# EAGLE design 360 led stick 3 layer (EAGLE 9.6.2)
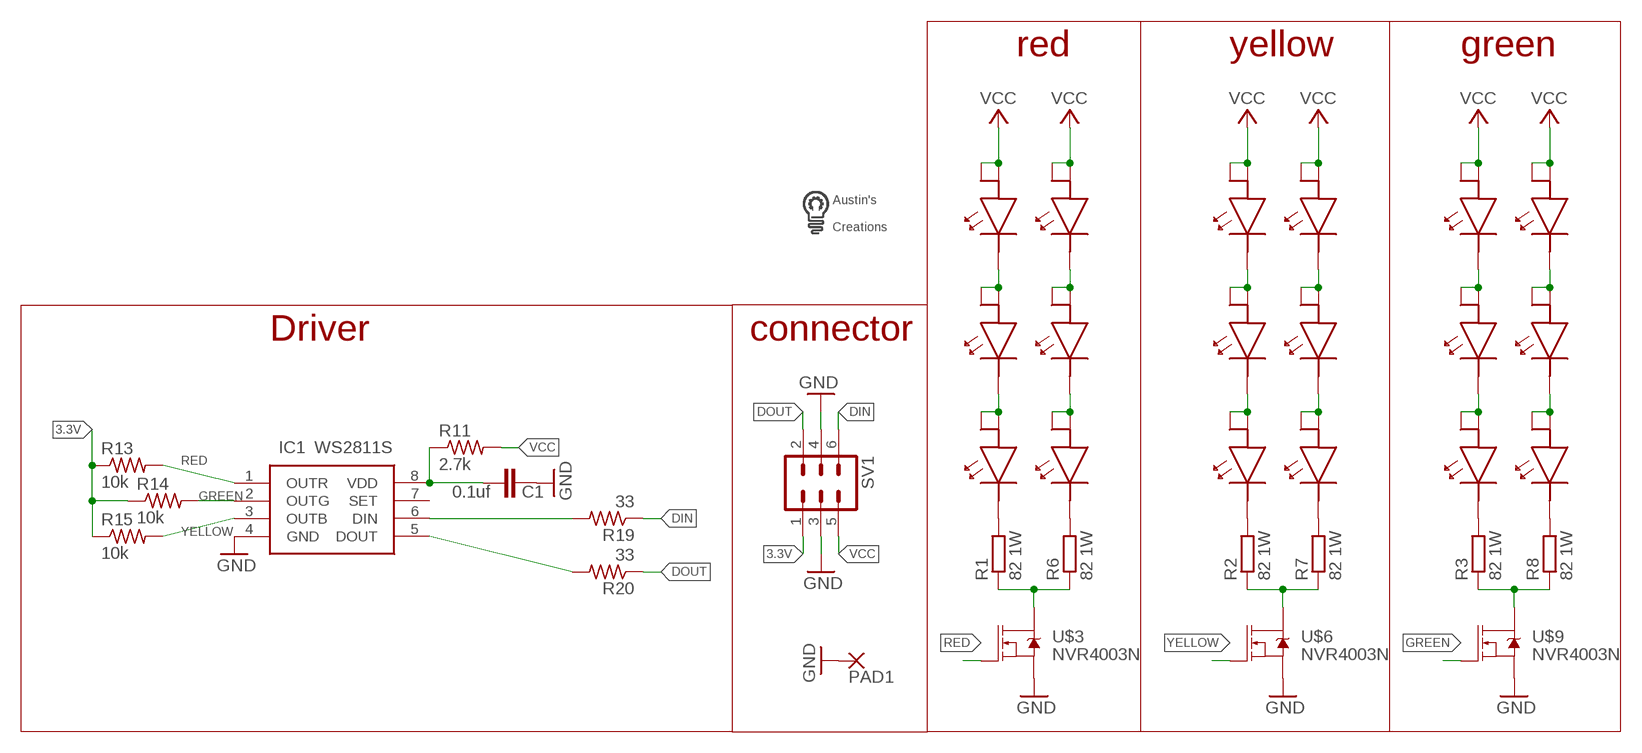
[diagram p0: schematic, sheet 1]

## Parts
C1  0.1uf  C-EUC0603K  [C0603K]
IC1  WS2811S  [SOIC127P600X175-8N]
PAD1  WIREPADSMD1,27-254  [SMD1,27-2,54]
R1  82 1W  R-EU_R1210  [R1210]
R2  82 1W  R-EU_R1210  [R1210]
R3  82 1W  R-EU_R1210  [R1210]
R6  82 1W  R-EU_R1210  [R1210]
R7  82 1W  R-EU_R1210  [R1210]
R8  82 1W  R-EU_R1210  [R1210]
R11  2.7k  R-US_R0603  [R0603]
R13  10k  R-US_R0603  [R0603]
R14  10k  R-US_R0603  [R0603]
R15  10k  R-US_R0603  [R0603]
R19  33  R-US_R0603  [R0603]
R20  33  R-US_R0603  [R0603]
SV1  MA03-2  [MA03-2]
U$1  5730LED  [5730LED]
U$2  5730LED  [5730LED]
U$3  NVR4003N  [SOT23]
U$4  5730LED  [5730LED]
U$5  5730LED  [5730LED]
U$6  NVR4003N  [SOT23]
U$7  5730LED  [5730LED]
U$8  5730LED  [5730LED]
U$9  NVR4003N  [SOT23]
U$10  5730LED  [5730LED]
U$11  5730LED  [5730LED]
U$13  5730LED  [5730LED]
U$21  LOGO  [LOGO]
U$22  5730LED  [5730LED]
U$23  5730LED  [5730LED]
U$24  5730LED  [5730LED]
U$25  5730LED  [5730LED]
U$26  5730LED  [5730LED]
U$27  5730LED  [5730LED]
U$28  5730LED  [5730LED]
U$29  5730LED  [5730LED]
U$30  5730LED  [5730LED]

## Nets
3.3V: R13.1 R14.1 R15.1 SV1.1
DIN: R19.1 SV1.6
DOUT: R20.1 SV1.2
GND: C1.1 IC1.4(GND) PAD1.1(P) SV1.3 SV1.4 U$3.3(S) U$6.3(S) U$9.3(S)
GREEN: IC1.2(OUTG) R14.2 U$9.2(G)
N$1: U$1.P$2 U$2.P$1 U$2.P$3
N$2: U$2.P$2 U$4.P$1 U$4.P$3
N$3: R1.2 U$4.P$2
N$4: U$5.P$2 U$7.P$1 U$7.P$3
N$5: U$7.P$2 U$8.P$1 U$8.P$3
N$6: R2.2 U$8.P$2
N$7: U$10.P$2 U$11.P$1 U$11.P$3
N$8: U$11.P$2 U$13.P$1 U$13.P$3
N$9: R3.2 U$13.P$2
N$10: IC1.5(DOUT) R20.2
N$16: R1.1 R6.1 U$3.1(D)
N$17: R2.1 R7.1 U$6.1(D)
N$18: R3.1 R8.1 U$9.1(D)
N$21: U$22.P$2 U$23.P$1 U$23.P$3
N$22: U$23.P$2 U$24.P$1 U$24.P$3
N$23: R6.2 U$24.P$2
N$24: U$25.P$2 U$26.P$1 U$26.P$3
N$25: U$26.P$2 U$27.P$1 U$27.P$3
N$26: R7.2 U$27.P$2
N$27: U$28.P$2 U$29.P$1 U$29.P$3
N$28: U$29.P$2 U$30.P$1 U$30.P$3
N$29: R8.2 U$30.P$2
N$39: C1.2 IC1.8(VDD) R11.1
N$40: IC1.6(DIN) R19.2
RED: IC1.1(OUTR) R13.2 U$3.2(G)
VCC: R11.2 SV1.5 U$1.P$1 U$1.P$3 U$5.P$1 U$5.P$3 U$10.P$1 U$10.P$3 U$22.P$1 U$22.P$3 U$25.P$1 U$25.P$3 U$28.P$1 U$28.P$3
YELLOW: IC1.3(OUTB) R15.2 U$6.2(G)
Unconnected: IC1.7(SET)

## Notes on the sheet
- red | yellow | green
- Driver | connector

## Library data of the parts
C1 = rcl:C-EU: CAPACITOR, European symbol; SPICEPREFIX: C
IC1 = SamacSys_Parts:WS2811S: RGB led driver Source: Datasheet <https://cdn-shop.adafruit.com/datasheets/WS2811.pdf>; DESCRIPTION: RGB led driver; HEIGHT: 1.75mm; MANUFACTURER_NAME: Worldsemi; MANUFACTURER_PART_NUMBER: ws2811s
PAD1 = wirepad:WIREPAD: Wire PAD connect wire on PCB
R1-R3 R6-R8 = resistor:R-EU_: RESISTOR, European symbol
R11 R13-R15 R19 R20 = resistor:R-US_: RESISTOR, American symbol
SV1 = con-lstb:MA03-2: PIN HEADER; OC_FARNELL: unknown; OC_NEWARK: unknown
U$1 U$2 U$4 U$5 U$7 U$8 U$10 U$11 U$13 U$22-U$30 = custom parts:5730LED
U$3 U$6 U$9 = custom parts:NVR4003N
U$21 = custom parts:LOGO

## Board
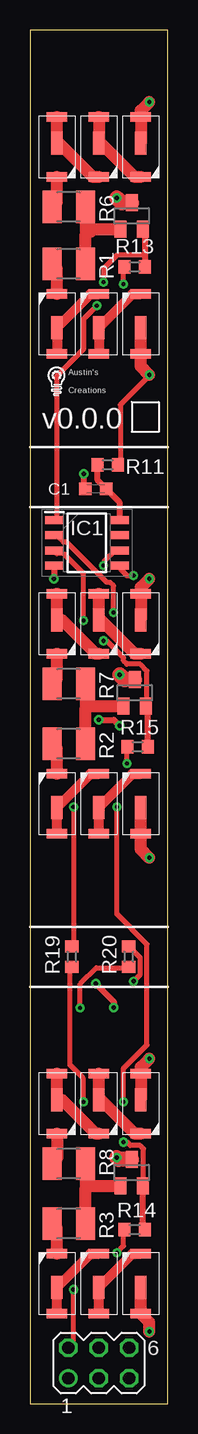
[diagram p1: board, top side]
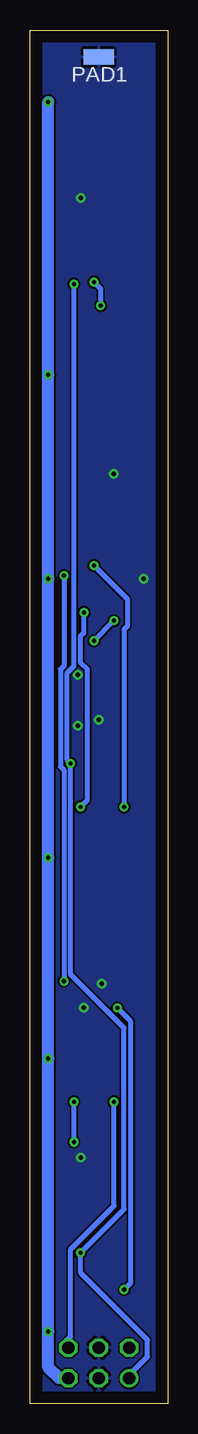
[diagram p2: board, bottom side, seen from below]

Size 11.5 x 114.5 mm. Coordinates in mm from the lower left corner, seen from the top.
Outline: 11.5,0 11.5,114.5 0,114.5 0,0 11.5,0
Copper layers (1*16): Top 0.035mm / dielectric 1.5mm / Bottom 0.035mm
Design rules "default *": minimum track width 16mil, minimum drill 0.35mm, track to track 6mil, track to pad 6mil, pad to pad 6mil, via to via 6mil, smd to smd 6mil, copper to edge 40mil, drill to drill 6mil, minimum pad ring 10mil, minimum via ring 8mil, stop-mask expansion 4mil, vias tented up to drill 0mil, thermal gap 10mil

### Footprints (pad centres in the part's own frame; a part is rotated, then mirrored left to right if it is on the bottom)
C0603K = smd 1.05 x 1.08: 1 -0.875,0; 2 0.875,0
SOIC127P600X175-8N = smd 1.55 x 0.65: 1 -2.725,1.905; 2 -2.725,0.635; 3 -2.725,-0.635; 4 -2.725,-1.905; 5 2.725,-1.905; 6 2.725,-0.635; 7 2.725,0.635; 8 2.725,1.905
SMD1,27-2,54 = smd 1.27 x 2.54: 1 0,0
R1210 = smd 1.6 x 2.7: 1 -1.4,0; 2 1.4,0
R0603 = smd 1 x 1.1: 1 -0.85,0; 2 0.85,0
MA03-2 = drill 1.016: 1 -2.54,-1.27 | drill 1.016 octagon: 2 -2.54,1.27; 3 0,-1.27; 4 0,1.27; 5 2.54,-1.27; 6 2.54,1.27
5730LED = smd 0.813 x 1.676: P$1 -2.5,0; P$2 2.5,0 | smd 1.93 x 0.965: P$3 -0.3,0
SOT23 = smd 1 x 1.4: 1 -0.95,-1.1; 2 0.95,-1.1; 3 0,1.1

### Placement (x,y rotation side)
C1  5.5,76.25 0 top
IC1  4.75,71.75 0 top
PAD1  5.75,112.25 90 bottom
R1  3.25,95 180 top
R2  3.25,55 180 top
R3  3.25,15 180 top
R6  3.25,99.75 180 top
R7  3.25,60 180 top
R8  3.25,20 180 top
R11  6.5,78.25 0 top
R13  8.75,94.75 0 top
R14  8.75,14.5 0 top
R15  9,54.75 0 top
R19  3.5,37.25 90 top
R20  8.25,37.25 90 top
SV1  5.75,3.38 0 top
U$1  9.25,90 90 top
U$2  5.75,90 90 top
U$3  8.5,99 0 top
U$4  2.25,90 90 top
U$5  9.25,50 90 top
U$6  8.75,59.25 0 top
U$7  5.75,50 90 top
U$8  2.25,50 90 top
U$9  8.5,19.25 0 top
U$10  9.25,10 90 top
U$11  5.75,10 90 top
U$13  2.25,10 90 top
U$21  1.5,84 0 top
U$22  9.25,104.75 270 top
U$23  5.75,104.75 270 top
U$24  2.25,104.75 270 top
U$25  9.25,65 270 top
U$26  5.75,65 270 top
U$27  2.25,65 270 top
U$28  9.25,25 270 top
U$29  5.75,25 270 top
U$30  2.25,25 270 top

### Tracks (layer width: path | path; a pad name or v marks a point on that pad's centre or on a via)
3.3V  (via drill 0.35)
  Top 0.406: v7.26,12.57 7.82,13.13 7.82,14.25 R14.1 | v8.1,53.37 8.1,54.48 R15.1 | v7.82,93.32 7.82,94.72 R13.1
  Bottom 0.406: SV1.1 3.35,2.23 1.68,3.91 1.68,5.31 7.26,10.9 v7.26,12.57 3.63,16.2 3.63,31.29 8.1,35.76 v8.1,53.37 8.38,53.65 8.38,60.91 7.82,61.47 v7.82,93.32
DIN  (via drill 0.35)
  Top 0.406: v4.47,25.15 4.47,27.1 3.35,28.22 3.35,36.32 R19.1
  Bottom 0.406: v4.47,25.15 4.47,16.48 8.1,12.85 8.1,5.59 8.38,5.31 8.38,4.75 SV1.6
DOUT  (via drill 0.35)
  Top 0.406: v4.19,32.97 4.19,34.97 5.54,36.32 8.1,36.32 R20.1 | v3.63,9.5 3.63,5.03 3.35,4.75 SV1.2
  Bottom 0.406: v4.19,32.97 3.07,31.85 3.07,10.06 v3.63,9.5
GND  (via drill 0.35)
  Top 0.508: IC1.4 2.02,68.78 v2,68.75 | C1.1 4.5,76.38 v4.5,77.5 | v5.75,57 7,57 v7.5,56.5 | v5.5,35 7,33.5 v7,33
  Top 1.27: U$3.3 7.65,100.1 v7.25,100.5 | U$6.3 7.9,60.35 v7.5,60.75 | U$9.3 7.4,20.35 v7.25,20.5
  pour Bottom: 0,114.5 0,0 11.5,0 11.5,114.5
GREEN  (via drill 0.35)
  Top 0.406: v6.99,65.94 6.99,68.17 6.71,68.45 6.43,68.45 3.07,71.81 2.79,71.81 2.23,72.36 IC1.2 | v7.26,49.73 7.26,40.79 9.78,38.28 9.78,29.9 7.82,27.94 v7.82,25.15 | v7.82,21.79 8.1,21.79 8.38,21.51 9.22,21.51 9.5,21.23 9.5,18.16 U$9.2
  Top 0.508: R14.2 9.45,14.65 U$9.2
  Bottom 0.406: v6.99,65.94 6.99,64.26 7.26,63.98 7.26,61.75 6.71,61.19 6.71,50.29 v7.26,49.73 | v7.82,21.79 v7.82,25.15
N$1
  Top 0.813: U$2.P$1 U$2.P$3 8.55,92.5 U$1.P$2
N$2
  Top 0.813: U$4.P$1 U$4.P$3 5.05,92.5 U$2.P$2
N$3
  Top 1.016: U$4.P$2 2.25,94.6 R1.2
N$4
  Top 0.813: U$7.P$1 U$7.P$3 8.55,52.5 U$5.P$2
N$5
  Top 0.813: U$8.P$1 U$8.P$3 5.05,52.5 U$7.P$2
N$6
  Top 1.016: U$8.P$2 2.25,54.6 R2.2
N$7
  Top 0.813: U$11.P$1 U$11.P$3 8.55,12.5 U$10.P$2
N$8
  Top 0.813: U$13.P$1 U$13.P$3 5.05,12.5 U$11.P$2
N$9
  Top 1.016: U$13.P$2 2.25,14.6 R3.2
N$10  (via drill 0.35)
  Top 0.406: v8.66,35.2 9.22,35.76 9.22,37.16 8.38,38 R20.2 | v8.66,69.01 8.1,69.01 7.54,69.57 IC1.5
  Bottom 0.406: v8.66,35.2 8.66,52.81 8.94,53.09 8.94,61.19 8.66,61.47 v8.66,69.01
N$16
  Top 1.016: 4.8,97.65 4.65,97.5 R1.1 | 4.8,97.65 5.05,97.65 5.3,97.9 U$3.1 | R6.1 4.65,97.8 4.8,97.65
N$17
  Top 1.016: 4.8,58.15 4.65,58 R2.1 | 4.8,58.15 U$6.1 | R7.1 4.65,58.3 4.8,58.15
N$18
  Top 1.016: R3.1 4.65,18 4.8,18.15 | 4.8,18.15 U$9.1 | R8.1 4.65,18.3 4.8,18.15
N$21
  Top 1.016: U$23.P$1 U$23.P$3 5.95,105.05 8.75,102.25 U$22.P$2
N$22
  Top 1.016: U$24.P$1 U$24.P$3 2.45,105.05 5.25,102.25 U$23.P$2
N$23
  Top 1.016: R6.2 2.25,100.15 U$24.P$2
N$24
  Top 1.016: U$26.P$1 U$26.P$3 5.95,65.3 8.75,62.5 U$25.P$2
N$25
  Top 1.016: U$27.P$1 U$27.P$3 2.7,65.3 5.5,62.5 U$26.P$2
N$26
  Top 1.016: R7.2 2.25,60.4 U$27.P$2
N$27
  Top 1.016: U$29.P$1 U$29.P$3 5.95,25.3 8.75,22.5 U$28.P$2
N$28
  Top 1.016: U$30.P$1 U$30.P$3 2.7,25.3 5.5,22.5 U$29.P$2
N$29
  Top 1.016: U$30.P$2 2.25,20.4 R8.2
N$39
  Top 0.508: IC1.8 7.47,75.15 C1.2 5.65,76.97 R11.1
N$40  (via drill 0.35)
  Top 0.406: v3.63,49.73 3.63,38.28 R19.2 | v6.15,69.85 6.15,70.13 7.26,71.25 IC1.6
  Bottom 0.406: v3.63,49.73 3.63,64.54 3.35,64.82 3.35,67.06 v6.15,69.85
RED  (via drill 0.35)
  Top 0.406: v5.59,91.52 4.47,90.41 4.47,87.89 2.23,85.66 2.23,73.92 IC1.1 | v6.15,93.48 6.15,94.6 7.26,95.71 9.6,95.71
  Top 0.508: U$3.2 9.6,97.75 9.6,95.71 R13.2
  Bottom 0.406: v5.59,91.52 5.59,92.92 v6.15,93.48
VCC  (via drill 0.35)
  Top 0.406: R11.2 7.54,78.51 7.54,83.26 9.78,85.5 v9.98,85.75
  Top 1.016: v9.98,108.5 9.25,107.77 U$22.P$1 U$22.P$3 | v9.98,85.75 9.25,86.48 U$1.P$1 U$1.P$3 | v9.98,68.75 9.25,68.02 U$25.P$1 U$25.P$3 | v9.98,45.5 9.25,46.23 U$5.P$1 U$5.P$3 | v9.98,28.75 9.25,28.02 U$28.P$1 U$28.P$3 | v9.98,6 9.98,6.77 U$10.P$1 U$10.P$3
  Bottom 1.016: SV1.5 9.08,2.1 9.98,3 v9.98,6 v9.98,28.75 v9.98,45.5 v9.98,68.75 v9.98,85.75 v9.98,108.5
YELLOW  (via drill 0.35)
  Top 0.406: v4.47,65.26 4.47,69.17 2.79,70.85 2.23,70.85 IC1.3 | v6.15,63.58 6.43,63.58 7.82,62.19 7.82,61.91 8.1,61.63 9.22,61.63 9.78,61.07 9.78,58.27 U$6.2
  Top 0.508: R15.2 9.85,58 U$6.2
  Bottom 0.406: v6.15,63.58 v4.47,65.26

### Text on the board
tNames: v0.0.0